# EAGLE design cool8 (EAGLE 5.11)
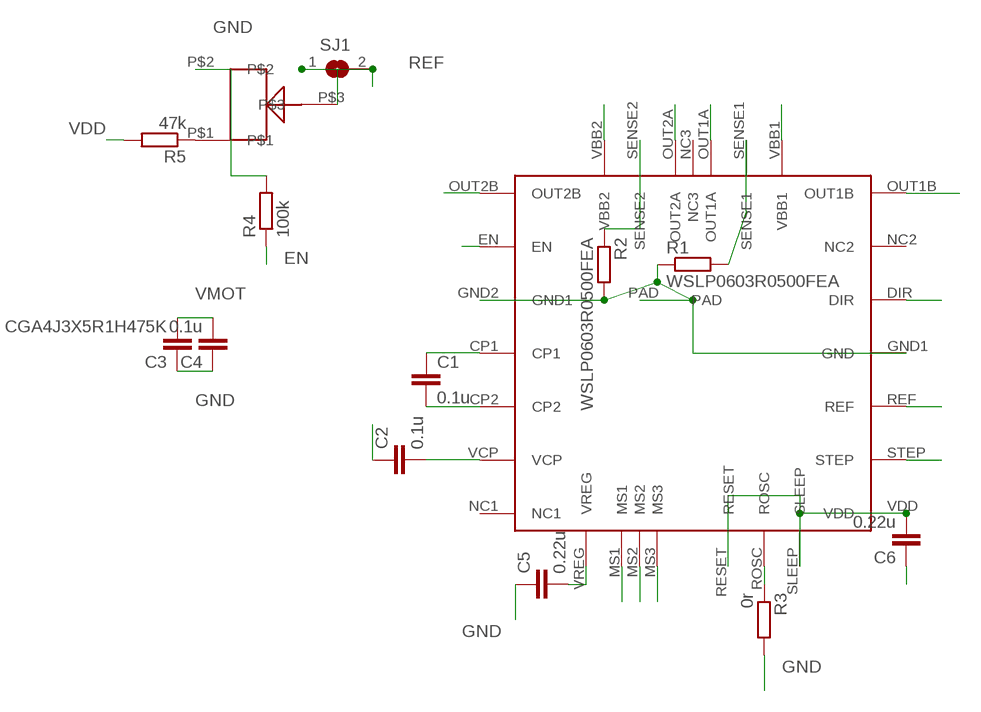
[diagram p0: schematic, sheet 1]

## Parts
C1  0.1u  C-EUC0603K  [C0603K]
C2  0.1u  C-EUC0603K  [C0603K]
C3  CGA4J3X5R1H475K  C-EUC0805K  [C0805K]
C4  0.1u  C-EUC0603K  [C0603K]
C5  0.22u  C-EUC0603K  [C0603K]
C6  0.22u  C-EUC0603  [C0603]
R1  WSLP0603R0500FEA  0805CS  [0805C]
R2  WSLP0603R0500FEA  0805CS  [0805C]
R3  0r  R-EU_R0603  [R0603]
R4  100k  R-EU_R0603  [R0603]
R5  47k  R-EU_R0603  [R0603]
SJ1  SJ  [SJ]
U$1  A4988  [A4988]
U$3  EVM-3YSX50B14  TRIMMER3MM  [TRIMMER3MM]

## Nets
1A: U$1.OUT1A
1B: U$1.OUT1B
2A: U$1.OUT2A
2B: U$1.OUT2B
DIR: U$1.DIR
EN: R4.1 U$1.EN
GND: C3.1 C4.1 C5.1 C6.1 R1.1 R2.2 R3.2 R4.2 U$1.GND1(GND) U$1.GND2(GND1) U$1.PAD U$3.P$2
MS1: U$1.MS1
MS2: U$1.MS2
MS3: U$1.MS3
N$2: C1.2 U$1.CP2
N$3: C5.2 U$1.VREG
N$4: R3.1 U$1.ROSC
N$5: R5.1 U$3.P$1
N$9: R2.1 U$1.SENSE2
N$10: R1.2 U$1.SENSE1
N$11: C1.1 U$1.CP1
N$12: C2.2 U$1.VCP
REF: SJ1.1 SJ1.2 U$1.REF U$3.P$3
STEP: U$1.STEP
VDD: C6.2 R5.2 U$1.RESET U$1.SLEEP U$1.VDD
VMOT: C2.1 C3.2 C4.2 U$1.VBB1 U$1.VBB2
Unconnected: U$1.NC1 U$1.NC2 U$1.NC3

## Library data of the parts
C1-C6 = rcl:C-EU: CAPACITOR, European symbol
R1 R2 = untitled:0805CS
R3-R5 = rcl:R-EU_: RESISTOR, European symbol
SJ1 = jumper:SJ: SMD solder JUMPER
U$1 = untitled:A4988
U$3 = untitled:TRIMMER3MM

## Board
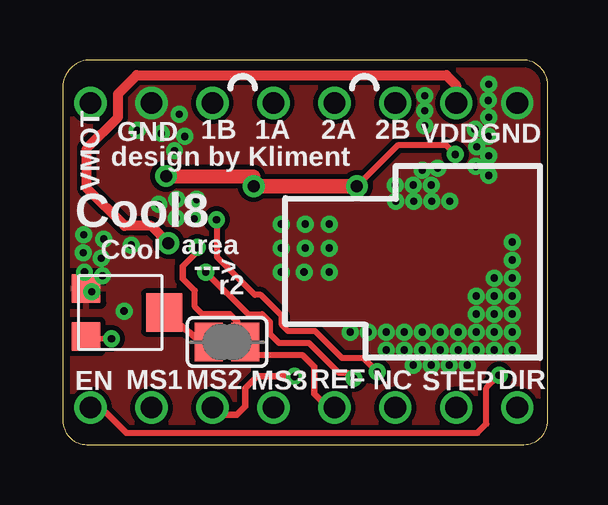
[diagram p1: board, top side]
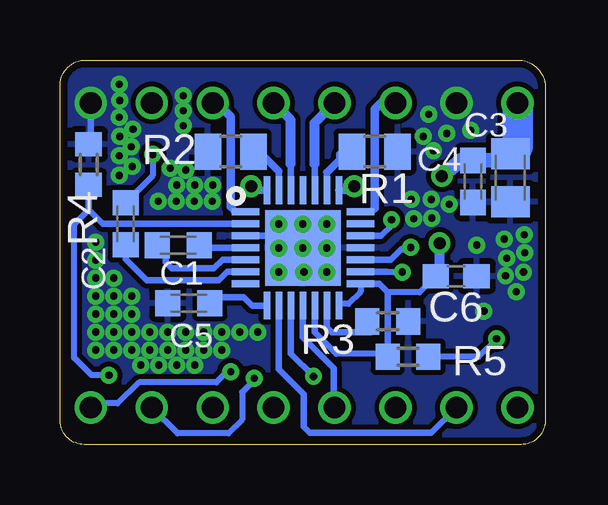
[diagram p2: board, bottom side, seen from below]

Size 20.22 x 16.02 mm. Coordinates in mm from the lower left corner, seen from the top.
Outline: 19.21,0 arc90 20.21,1 20.21,14.8 arc90 19.26,16.02 1.05,16.02 arc90 0,14.8 0,1 arc90 1,0 19.21,0
Copper layers (1*16): Top 0.035mm / dielectric 1.5mm / Bottom 0.035mm
Design rules "default *": minimum track width 10mil, minimum drill 0.3mm, track to track 8mil, track to pad 8mil, pad to pad 8mil, via to via 8mil, smd to smd 0mil, copper to edge 0.3mm, drill to drill 8mil, minimum pad ring 10mil, minimum via ring 8mil, stop-mask expansion 2mil, vias tented up to drill 40mil, thermal gap 10mil

### Footprints (pad centres in the part's own frame; a part is rotated, then mirrored left to right if it is on the bottom)
C0603K = smd 1.05 x 1.08: 1 -0.875,0; 2 0.875,0
C0805K = smd 1.3 x 1.6: 1 -1,0; 2 1,0
C0603 = smd 1.1 x 1: 1 -0.85,0; 2 0.85,0
0805C = smd 1.1 x 1.5: 1 -0.95,0; 2 0.95,0
R0603 = smd 1 x 1.1: 1 -0.85,0; 2 0.85,0
SJ = smd 1.168 x 1.6: 1 -0.762,0; 2 0.762,0
A4988 = smd 1.15 x 0.28: CP1 -2.4,0; CP2 -2.4,-0.5; DIR 2.4,0.5; EN -2.4,1; GND1 -2.4,0.5; GND2 2.4,0; NC1 -2.4,-1.5; NC2 2.4,1; OUT1B 2.4,1.5; OUT2B -2.4,1.5; REF 2.4,-0.5; STEP 2.4,-1; VCP -2.4,-1; VDD 2.4,-1.5 | smd 0.28 x 1.15: MS1 -1,-2.4; MS2 -0.5,-2.4; MS3 0,-2.4; NC3 0,2.4; OUT1A 0.5,2.4; OUT2A -0.5,2.4; RESET 0.5,-2.4; ROSC 1,-2.4; SENSE1 1,2.4; SENSE2 -1,2.4; SLEEP 1.5,-2.4; VBB1 1.5,2.4; VBB2 -1.5,2.4; VREG -1.5,-2.4 | smd 3.15 x 3.15: PAD 0,0
TRIMMER3MM = smd 1.2 x 1.2: P$1 1,-1.6; P$2 -1,-1.6 | smd 1.6 x 1.5: P$3 0,1.65

### Placement (x,y rotation side)
C1  15.29,8.31 180 bottom
C2  17.48,9.2 270 bottom
C3  1.45,11.12 90 bottom
C4  3.01,10.96 90 bottom
C5  14.85,5.89 0 bottom
C6  3.71,7.02 180 bottom
R1  7.1,12.21 180 bottom
R2  13.1,12.21 180 bottom
R3  6.56,5.13 0 bottom
R4  19.02,11.67 90 bottom
R5  5.72,3.66 180 bottom
SJ1  6.84,4.28 0 top
U$1  10.09,8.2 0 bottom
U$3  2.57,5.5 270 top

### Tracks (layer width: path | path; a pad name or v marks a point on that pad's centre or on a via)
1A  (via drill 0.9)
  Bottom 0.28: U$1.OUT1A 9.59,11.69
  Bottom 0.305: 9.59,11.69 9.6,11.69
  Bottom 0.406: 9.6,11.69 9.6,13.41 v8.77,14.24
1B  (via drill 0.9)
  Bottom 0.305: 7.1,9.84 7.24,9.7 U$1.OUT1B
  Bottom 0.35: v6.23,14.24 6.83,14.24 7.1,13.96
  Bottom 0.355: 7.1,9.84 7.1,13.96
2A  (via drill 0.9)
  Bottom 0.28: U$1.OUT2A 10.59,11.69
  Bottom 0.305: 10.59,11.69 10.6,11.69
  Bottom 0.406: 10.6,11.69 10.6,13.53 v11.31,14.24
2B  (via drill 0.9)
  Bottom 0.305: 13.1,9.92 12.91,9.7 U$1.OUT2B
  Bottom 0.35: 13.1,9.92 13.1,13.67 13.68,14.24 v13.85,14.24
DIR  (via drill 0.3, 0.9)
  Top 0.254: v13.1,3.04 12.53,3.62 11.63,3.62 10.5,4.74 9.38,4.74 9.13,4.99 9.13,5.37 8.25,6.24 8,6.24 6.43,7.82 6.43,9.34 v6.4,9.37
  Bottom 0.254: v13.1,3.04 13.28,3.04 13.7,2.59 16.93,2.59 17.83,1.72 18.76,1.72 v18.93,1.54 | 6.84,8.7 6.4,9.14 v6.4,9.37
  Bottom 0.28: 6.84,8.7 U$1.DIR
EN  (via drill 0.3, 0.9)
  Top 0.254: 2.65,0.49 17.28,0.49 17.65,0.86 17.65,2.37 v18.18,2.89
  Top 0.28: v1.15,1.54 1.6,1.54 2.65,0.49
  Bottom 0.254: v18.18,2.89 18.9,2.89 19.63,3.62 19.63,9.18 19.02,9.78
  Bottom 0.28: U$1.EN 18.44,9.2 19.02,9.78 R4.1 19.02,10.87 18.95,10.94
GND  (via drill 0.3, 0.9)
  Bottom 0.28: 11.59,8.7 U$1.GND1 | 11.59,8.7 v11.1,9.19 v10.1,9.19 U$1.PAD | v9.1,8.19 v9.09,8.2 | v9.1,8.19 v9.1,9.19 | v9.1,8.19 v9.1,7.19 v10.05,7.19 | v9.1,8.19 U$1.PAD | 11.59,8.7 11.59,8.68 v11.1,8.19 v11.1,7.19 | U$1.PAD v10.1,8.19 | v18.93,14.24 18.93,12.61 R4.2
  other vias: 3.69,14.24 17.75,13.64 17.75,12.04 15.08,13.29 15.63,11.52 17.18,13.14 17.75,11.21 14.63,10.14 17.2,11.59 17.73,12.84 12.73,4.69 4.85,13.77 5.08,12.84 4.1,12.96 3.1,13.09 4.65,12.24 5.58,10.21 2.85,8.31 5.48,9.42 4.75,10.21 0.88,8.74 1.7,8.56 0.85,7.99 1.6,7.77 0.9,7.19 1.65,7.04 1.2,6.37 2.55,5.57 4,10.02 4.73,9.44 13.48,4.69 14.23,4.69 14.98,4.69 15.73,4.69 16.48,4.69 17.23,4.69 17.98,4.69 13.48,3.94 14.23,3.94 14.98,3.94 15.73,3.94 16.48,3.94 17.23,3.94 17.98,3.94 17.98,5.44 17.23,5.44 17.23,6.19 17.98,6.19 17.98,6.94 16.13,10.14 15.38,10.14 13.88,10.14 18.73,7.69 18.73,8.44 18.73,6.94 18.73,6.19 18.73,5.44 18.73,4.69 18.73,3.94 11.98,4.69 16.85,3.32 16.1,3.32 15.35,3.32 14.6,3.32 13.85,10.81 14.6,10.81 15.35,10.81 14.98,11.44 15.08,14.54 15.08,13.92 17.73,14.34 17.75,15.02 17.25,12.42
  pour Bottom: -0.62,16.46 20.88,16.46 20.88,-0.61 -0.72,-0.61 -0.72,16.36
  pour Top: -0.85,17.46 20.68,17.46 20.68,-0.58 -1.2,-0.58 -1.2,17.16
MS1  (via drill 0.9)
  Bottom 0.28: U$1.MS1 11.09,3.13 10.05,2.09 10.05,0.74 9.8,0.49 4.74,0.49 v3.69,1.54
MS2  (via drill 0.3, 0.9)
  Top 0.28: v9.65,2.84 8.1,2.84 7.6,2.34 7.6,1.59 7.25,1.24 6.53,1.24 v6.23,1.54
  Bottom 0.28: U$1.MS2 10.59,3.78 v9.65,2.84
MS3  (via drill 0.9)
  Bottom 0.28: U$1.MS3 10.09,4.48 8.8,3.19 8.8,1.57 v8.77,1.54
N$2
  Bottom 0.28: U$1.CP2 13.44,7.7 13.8,7.34 15.55,7.34 15.8,7.59 15.8,8.1 C1.2
N$3
  Bottom 0.28: C5.2 13.98,5.96 13.8,6.14 12.55,6.14 12.2,5.79 U$1.VREG
N$4
  Bottom 0.28: U$1.ROSC 9.09,4.88 8.9,4.69 7.26,4.69 R3.1
N$5  (via drill 0.3)
  Top 0.254: U$3.P$1 1.14,4.43 v2.03,4.42
  Bottom 0.254: R5.1 2.78,3.66 v2.03,4.42
N$9
  Bottom 0.28: U$1.SENSE2 11.09,11.39
  Bottom 0.305: R2.1 12.1,12.4 11.09,11.39
N$10
  Bottom 0.28: U$1.SENSE1 9.09,11.34
  Bottom 0.305: 9.09,11.34 9.08,11.34 8.55,11.87 8.55,12.11 R1.2
N$11
  Bottom 0.28: U$1.CP1 13.86,8.2 C1.1
N$12
  Bottom 0.28: U$1.VCP 13.24,7.2 13.6,6.84 16.6,6.84 17.48,7.72 C2.2
NC  (via drill 0.9)
  other vias: 13.85,1.54
REF  (via drill 0.3, 0.9)
  Top 0.254: SJ1.1 SJ1.2 7.61,3.89 7.75,3.74 9.98,3.74 10.48,3.24 | 6.48,5.44 5.8,5.44 5.5,5.74 5.5,6.42 5,6.92 | 10.48,2.12 11.06,1.54 v11.31,1.54
  Top 0.28: 10.48,3.24 10.48,2.12 | U$3.P$3 5.93,4.13 SJ1.1 | v5.6,8.21 5.6,8.04 5,7.44 5,6.92 | 6.48,5.44 6.95,5.44 7.28,5.12 7.28,4.3 SJ1.2
  Bottom 0.28: U$1.REF 6.44,7.7 6,8.14 5.68,8.14 v5.6,8.21
STEP  (via drill 0.3, 0.9)
  Top 0.254: 7.73,5.44 8.3,5.44 8.63,5.12 8.63,4.62 9,4.24 10.25,4.24 11.5,2.99 11.9,2.99 v12.13,2.77
  Top 0.28: v5.95,7.19 7.73,5.44
  Bottom 0.254: v12.13,2.77 12.13,2.69 12.63,2.19 12.63,1.04 13.2,0.46 15.32,0.46 v16.39,1.54
  Bottom 0.28: U$1.STEP 6.59,7.2 v5.95,7.19
VDD  (via drill 0.5, 0.9)
  Top 0.406: v16.39,14.24 16.39,14.97 15.98,15.39 3.08,15.39 2.3,14.62 2.3,13.64 1,12.34 1,10.69 2.58,9.12 3.68,9.12 v4.4,8.39
  Bottom 0.254: U$1.SLEEP 8.53,5.87 8.2,5.87 7.69,6.38 U$1.VDD | 6.55,3.99 6.55,3.43 R5.2 6.7,3.79 8.7,3.79 | 6.55,6.34 5.24,6.34 C6.2
  Bottom 0.28: U$1.RESET 9.59,4.68 8.7,3.79 | U$1.VDD 6.91,6.7 6.55,6.34 6.55,3.99
  Bottom 0.406: v4.4,8.39 4.4,7.17 C6.2
VMOT  (via drill 0.3, 0.5, 0.9)
  Top 0.254: v16.35,12.09 15.95,12.49 13.98,12.49 v12.25,10.77
  Top 0.61: v7.95,10.77 v12.25,10.77 | v7.95,10.77 7.98,10.74 | v4.3,11.19 7.93,11.17 v7.95,10.77
  Bottom 0.254: C2.1 16.35,11.21 v16.35,12.09
  Bottom 0.28: C2.1 17.48,9.97 17.3,9.79
  Bottom 0.305: v7.95,10.77 7.93,10.59 U$1.VBB1 | v12.25,10.77 12.26,10.59 U$1.VBB2
  Bottom 0.61: C3.2 1.73,11.84 C4.2 3.53,11.84 v4.3,11.19
  Bottom 1.27: v1.15,14.24 1.15,12.42 C3.2

### Text on the board
tPlace: GND | 1B | 1A | 2A | 2B | VDD | GND | design by Kliment | VMOT | Cool8 | Cool | area | ---> | r2 | EN | NC | MS1 | MS2 | MS3 | REF | STEP | DIR